# Altium schematic sheet COOP4403.SchDoc
size A3
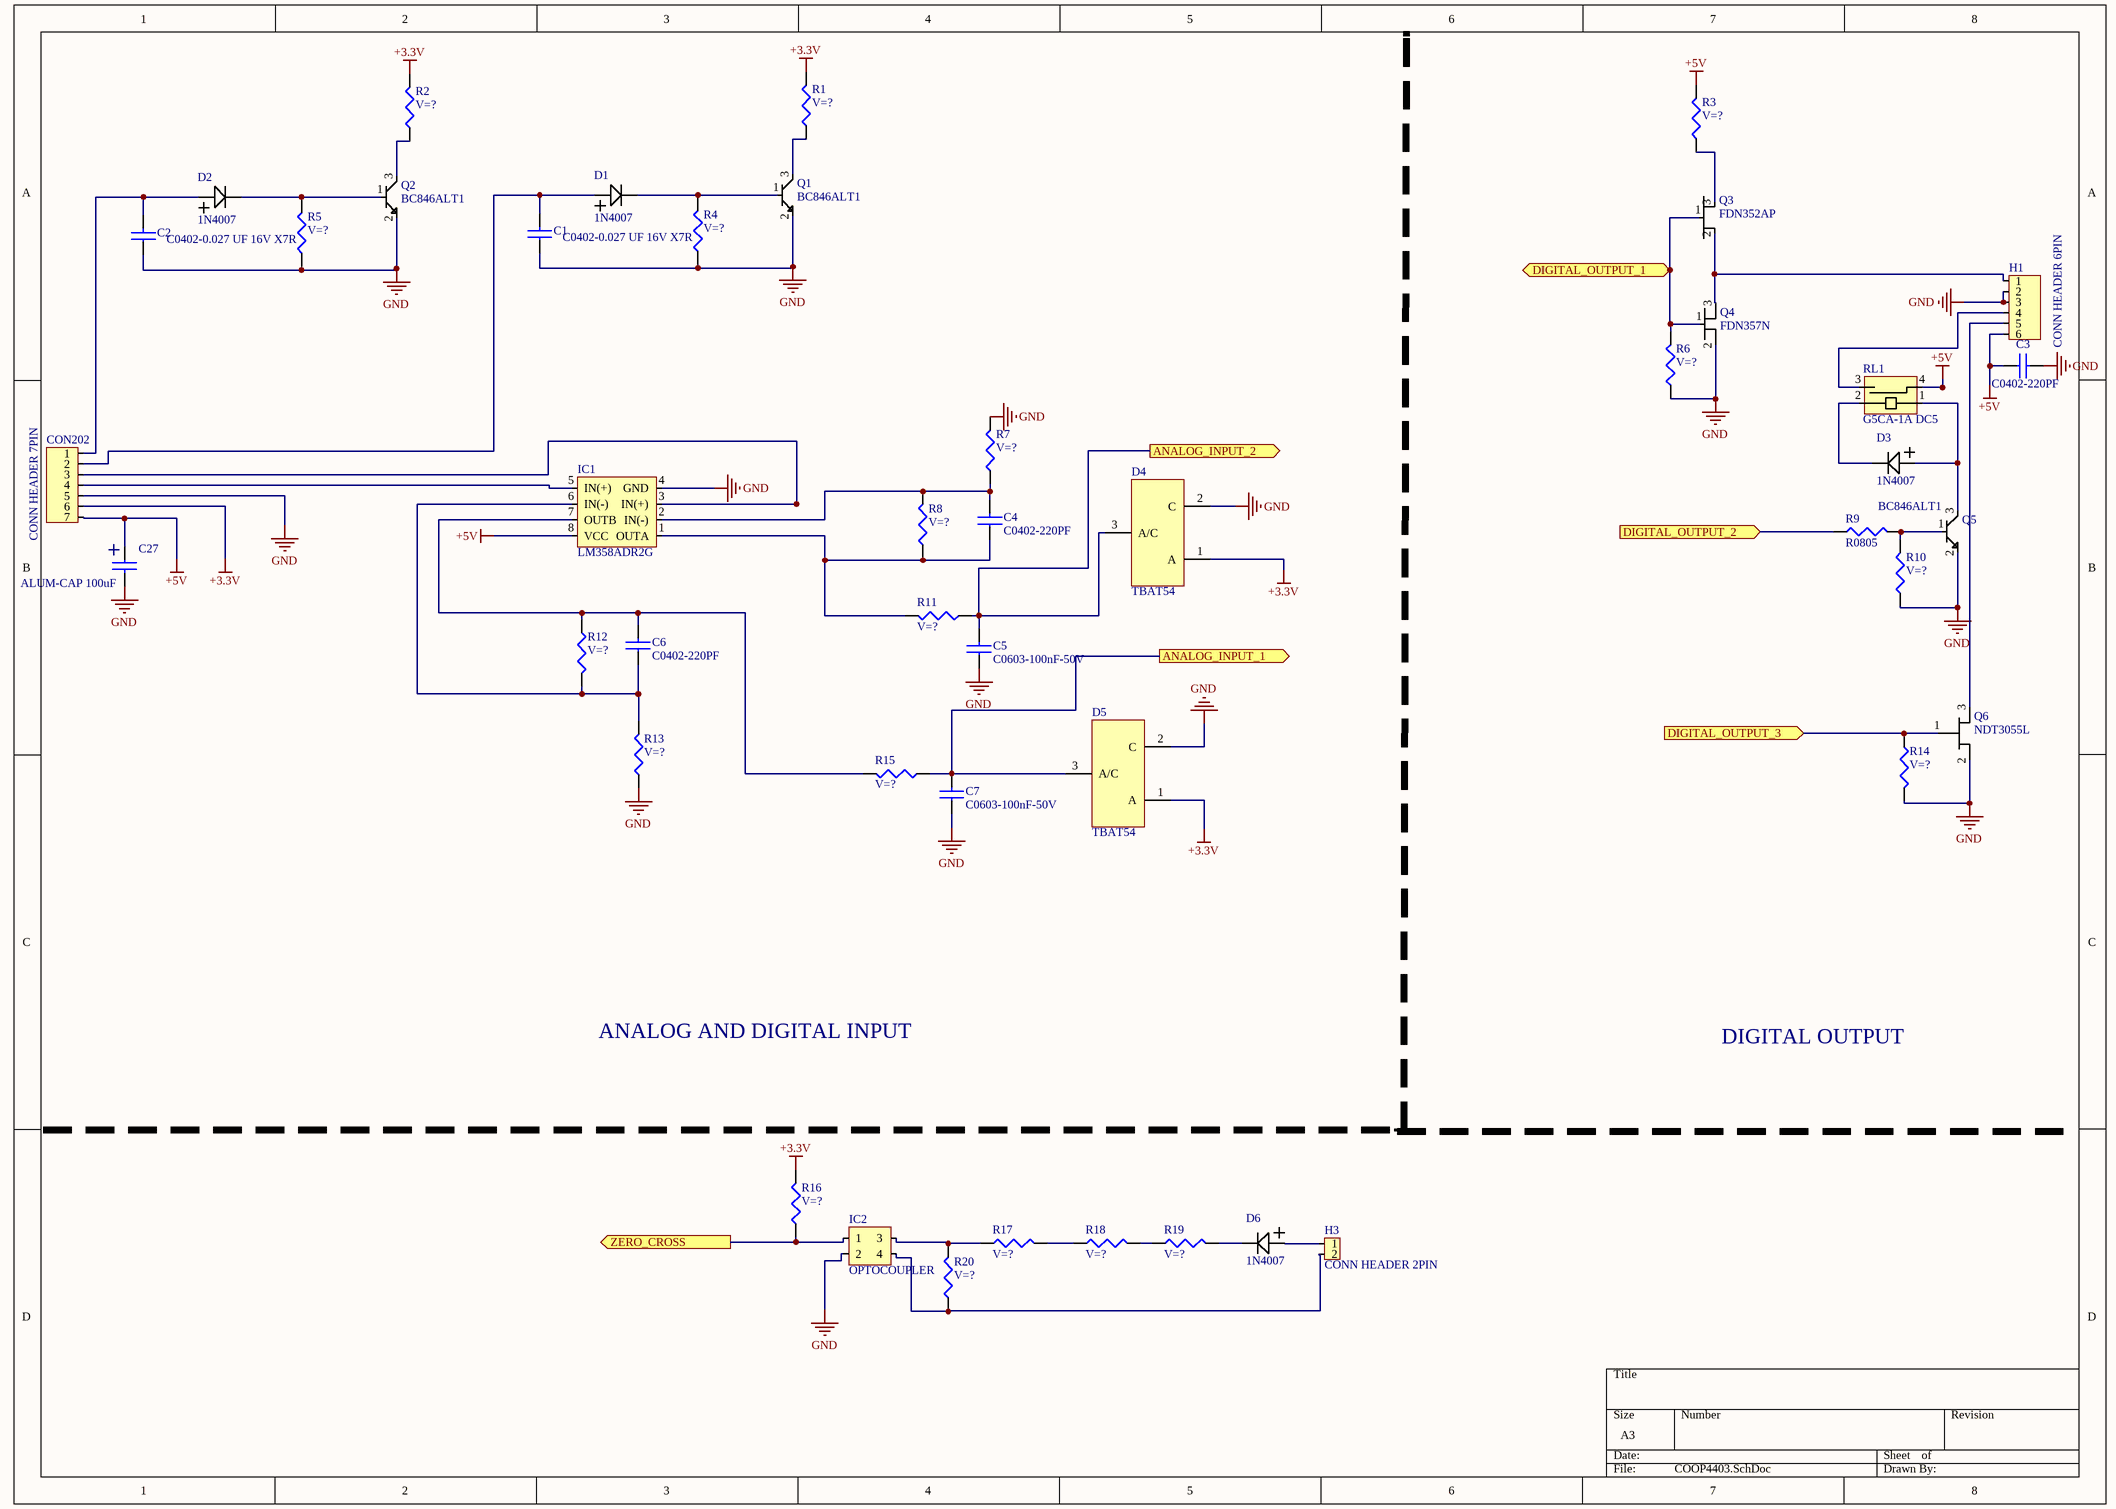
[diagram p0: COOP4403.SchDoc]

## Parts
C1  C0402-0.027 UF 16V X7R  [C0402]
C2  C0402-0.027 UF 16V X7R  [C0402]
C3  C0402-220PF  [C0402]
C4  C0402-220PF  [C0402]
C5  C0603-100nF-50V  [C0603]
C6  C0402-220PF  [C0402]
C7  C0603-100nF-50V  [C0603]
C27  ALUM-CAP 100uF  [ALUM-CAP]
CON202  CONN HEADER 7PIN  [CON HEADER 7PIN]
D1  1N4007  [sm4007]
D2  1N4007  [sm4007]
D3  1N4007  [sm4007]
D4  TBAT54  [SOT95P245X110-3N]
D5  TBAT54  [SOT95P245X110-3N]
D6  1N4007  [sm4007]
H1  CONN HEADER 6PIN  [CON HEADER 6PIN]
H3  CONN HEADER 2PIN  [CON HEADER 2PIN]
IC1  LM358ADR2G  [SOP127P700X380-8N]
IC2  OPTOCOUPLER  [4DIP_OPTO - duplicate]
Q1  BC846ALT1  [BC846ALT]
Q2  BC846ALT1  [BC846ALT]
Q3  FDN352AP  [FDN]
Q4  FDN357N  [FDN]
Q5  BC846ALT1  [BC846ALT]
Q6  NDT3055L  [realndt]
R1  V=?  [r0402]
R2  V=?  [r0402]
R3  V=?  [r0402]
R4  V=?  [R603]
R5  V=?  [R603]
R6  V=?  [R603]
R7  V=?  [r0402]
R8  V=?  [r0402]
R9  R0805  [R0805]
R10  V=?  [r0402]
R11  V=?  [r0402]
R12  V=?  [r0402]
R13  V=?  [r0402]
R14  V=?  [R603]
R15  V=?  [r0402]
R16  V=?  [r0402]
R17  V=?  [R1206]
R18  V=?  [R1206]
R19  V=?  [R1206]
R20  V=?  [R603]
RL1  G5CA-1A DC5  [RELAY OMRON]

## Ports
ANALOG_INPUT_1 (out), ANALOG_INPUT_2 (out), DIGITAL_OUTPUT_1 (in), DIGITAL_OUTPUT_2 (in), DIGITAL_OUTPUT_3 (in), ZERO_CROSS (out)

## Nets
+3.3V: CON202.6 D4.1(A) D5.1(A) R1.2 R2.2 R16.2
+5V: C3.1 C27.1 CON202.7 H1.6 IC1.8(VCC) R3.2 RL1.4
GND: C1.1 C2.1 C3.2 C5.1 C7.1 C27.2 CON202.5 D4.2(C) D5.2(C) H1.2 H1.3 IC1.4(GND) IC2.2 Q1.2 Q2.2 Q4.2 Q5.2 Q6.2 R4.1 R5.1 R6.1 R7.2 R10.1 R13.1 R14.2
ANALOG_INPUT_1: C7.2 D5.3(A/C) R15.1 ; port ANALOG_INPUT_1
ANALOG_INPUT_2: C5.2 D4.3(A/C) R11.1 ; port ANALOG_INPUT_2
DIGITAL_OUTPUT_1: Q3.1 Q4.1 R6.2 ; port DIGITAL_OUTPUT_1
DIGITAL_OUTPUT_2: R9.1 ; port DIGITAL_OUTPUT_2
DIGITAL_OUTPUT_3: Q6.1 R14.1 ; port DIGITAL_OUTPUT_3
ZERO_CROSS: IC2.1 R16.1 ; port ZERO_CROSS
NetC1_2: C1.2 CON202.2 D1.1
NetC2_2: C2.2 CON202.1 D2.1
NetC4_1: C4.1 IC1.1(OUTA) R8.1 R11.2
NetC4_2: C4.2 IC1.2(IN(-)) R7.1 R8.2
NetC6_1: C6.1 IC1.6(IN(-)) R12.2 R13.2
NetC6_2: C6.2 IC1.7(OUTB) R12.1 R15.2
NetCON202_3: CON202.3 IC1.3(IN(+))
NetCON202_4: CON202.4 IC1.5(IN(+))
NetD1_2: D1.2 Q1.1 R4.2
NetD2_2: D2.2 Q2.1 R5.2
NetD3_1: D3.1 Q5.3 RL1.1
NetD3_2: D3.2 RL1.2
NetD6_1: D6.1 H3.1
NetD6_2: D6.2 R19.2
NetH1_1: H1.1 Q3.2 Q4.3
NetH1_4: H1.4 RL1.3
NetH1_5: H1.5 Q6.3
NetH3_2: H3.2 IC2.4 R20.1
NetIC2_3: IC2.3 R17.1 R20.2
NetQ1_3: Q1.3 R1.1
NetQ2_3: Q2.3 R2.1
NetQ3_3: Q3.3 R3.1
NetQ5_1: Q5.1 R9.2 R10.2
NetR17_2: R17.2 R18.1
NetR18_2: R18.2 R19.1

## Notes on the sheet
- ANALOG AND DIGITAL INPUT
- DIGITAL OUTPUT

## Library data of the parts
C1 C2 = C0402-0.027 UF 16V X7R: CAP CER 0.027 UF 16V X7R
C3 C4 C6 = C0402-220PF: CAP CER 220PF 50V C0G/NP0 0402
C5 C7 = C0603-100nF-50V: CL10B104KB8NNNC
C27 = ALUM-CAP 100uF: CAP ALUM 100uF 20% 35V Radial
CON202 = CONN HEADER 7PIN: B7B-XHA
D1-D3 D6 = 1N4007: ONSEMI 1N4007
H1 = CONN HEADER 6PIN: B6B-XHA
H3 = CONN HEADER 2PIN: B2P-VHLFSN
Q1 Q2 Q5 = BC846ALT1: BJT TRANSISTOR NPN 65V 100MA
Q3 = FDN352AP: MOSFET SINGLE PCH TRENCH
Q4 = FDN357N: N CHANNEL LOGIC LEVEL ENGANCEMENT MODE FIELD EFFECT TRANSISTOR
Q6 = NDT3055L: N CHANNEL LOGIC LEVEL ENHANCEMENET MODE FIELD EFFECT TRANSISTOR
R1-R3 R7 R8 R10-R13 R15 R16 = R0402: RESISTOR
R4-R6 R14 R20 = R0603: CRCW06034R70FNEA
R17-R19 = R1206: ERJ-8ENF10R0V
RL1 = G5CA-1A DC5: RELAY GEN PURPOSES SPST 10A 5V